# Altium project BATT_ctrl_v2.3.PrjPcb
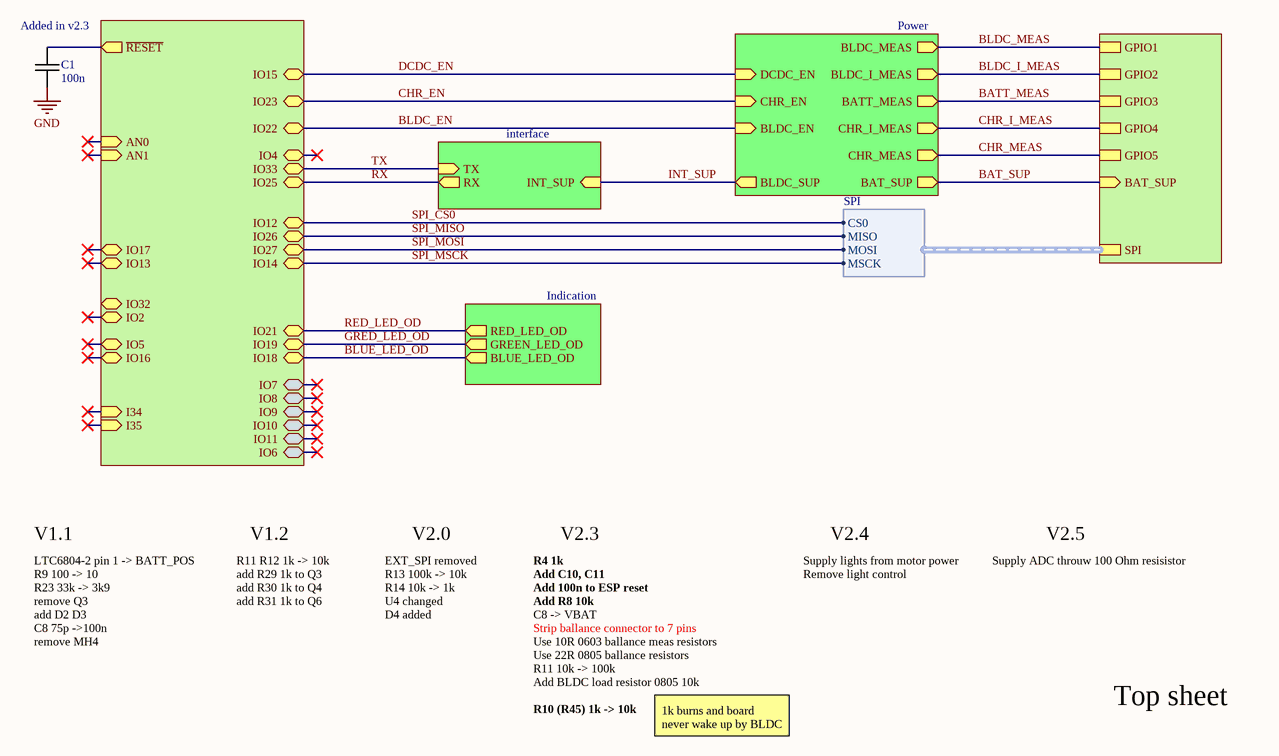
[diagram p0: top_sheet.SchDoc]
4 sheets, 67 parts. Net scope: hierarchical (ports join the sheet entries above them; power ports are global).
Board file: batt_ctrl_pcb_v2.5.PcbDoc
Sheets:
  top_sheet.SchDoc
    Power = power.SchDoc
    interface = data_interface.SchDoc
    Indication = indication.SchDoc

## Sheet top_sheet.SchDoc
size A4; SheetNumber: 1; SheetTotal: 7

### Parts
C1  100n  [CAPC0603(1608)55_N]

### Sub-sheets
Indication = indication.SchDoc: RED_LED_OD (out), GREEN_LED_OD (out), BLUE_LED_OD (out)
interface = data_interface.SchDoc: TX (in), RX (out), INT_SUP (in)
Power = power.SchDoc: BLDC_EN (in), BLDC_I_MEAS (out), CHR_EN (in), CHR_I_MEAS (out), BLDC_MEAS (out), CHR_MEAS (out), BATT_MEAS (out), BAT_SUP (out), DCDC_EN (in), BLDC_SUP (out)
U_ESP32_WROOM2 = ESP32_WROOM2 (file not in this document): IO25 (bidir), IO26 (bidir), IO27 (bidir), IO22 (bidir), IO23 (bidir), IO32 (bidir), IO19 (bidir), IO21 (bidir), IO33 (bidir), IO14 (bidir), IO12 (bidir), IO15 (bidir), IO16 (bidir), IO17 (bidir), IO18 (bidir), IO13 (bidir), I34 (in), I35 (in), IO5 (bidir), IO4 (bidir), IO2 (bidir), AN0 (in), AN1 (in), IO7 (bidir), IO8 (bidir), IO9 (bidir), IO10 (bidir), IO11 (bidir), IO6 (bidir), ~{RESET} (out)
U_LTC6804-2_BMS_TR = LTC6804-2_BMS_TR (file not in this document): SPI (harness SPI), GPIO1, GPIO2, GPIO3, GPIO4, GPIO5, BAT_SUP (in)

### Harnesses
SPI: CS0, MISO, MOSI, MSCK

### Nets
BAT_SUP: sheet Power/BAT_SUP, sheet U_LTC6804-2_BMS_TR/BAT_SUP
GND: C1.2
BATT_MEAS: sheet Power/BATT_MEAS, sheet U_LTC6804-2_BMS_TR/GPIO3
BLDC_EN: sheet U_ESP32_WROOM2/IO22, sheet Power/BLDC_EN
BLDC_I_MEAS: sheet Power/BLDC_I_MEAS, sheet U_LTC6804-2_BMS_TR/GPIO2
BLDC_MEAS: sheet Power/BLDC_MEAS, sheet U_LTC6804-2_BMS_TR/GPIO1
BLUE_LED_OD: sheet U_ESP32_WROOM2/IO18, sheet Indication/BLUE_LED_OD
CHR_EN: sheet U_ESP32_WROOM2/IO23, sheet Power/CHR_EN
CHR_I_MEAS: sheet Power/CHR_I_MEAS, sheet U_LTC6804-2_BMS_TR/GPIO4
CHR_MEAS: sheet Power/CHR_MEAS, sheet U_LTC6804-2_BMS_TR/GPIO5
DCDC_EN: sheet U_ESP32_WROOM2/IO15, sheet Power/DCDC_EN
GRED_LED_OD: sheet U_ESP32_WROOM2/IO19, sheet Indication/GREEN_LED_OD
INT_SUP: sheet Power/BLDC_SUP, sheet interface/INT_SUP  [project net BLDC_POS]
RED_LED_OD: sheet U_ESP32_WROOM2/IO21, sheet Indication/RED_LED_OD
RX: sheet U_ESP32_WROOM2/IO25, sheet interface/RX
SPI_CS0: sheet U_ESP32_WROOM2/IO12, sheet U_LTC6804-2_BMS_TR/SPI.CS0
SPI_MISO: sheet U_ESP32_WROOM2/IO26, sheet U_LTC6804-2_BMS_TR/SPI.MISO
SPI_MOSI: sheet U_ESP32_WROOM2/IO27, sheet U_LTC6804-2_BMS_TR/SPI.MOSI
SPI_MSCK: sheet U_ESP32_WROOM2/IO14, sheet U_LTC6804-2_BMS_TR/SPI.MSCK
TX: sheet U_ESP32_WROOM2/IO33, sheet interface/TX
NetC1_1: C1.1 ; sheet U_ESP32_WROOM2/~{RESET}

### Notes on the sheet
- (near C1) Added in v2.3
- V1.1
- LTC6804-2 pin 1 -> BATT_POS
- R11 R12 1k -> 10k
- V1.2
- EXT_SPI removed
- V2.0
- R4 1k
- V2.3
- Supply lights from motor power
- V2.4
- Supply ADC throuw 100 Ohm resisistor
- V2.5
- R9 100 -> 10
- R23 33k -> 3k9
- remove Q3
- add D2 D3
- C8 75p ->100n
- add R29 1k to Q3
- add R30 1k to Q4
- add R31 1k to Q6
- R13 100k -> 10k
- R14 10k -> 1k
- U4 changed
- D4 added
- Add C10, C11
- Add 100n to ESP reset
- Strip ballance connector to 7 pins
- C8 -> VBAT
- Add R8 10k
- Remove light control
- remove MH4
- Use 10R 0603 ballance meas resistors
- R11 10k -> 100k
- Use 22R 0805 ballance resistors
- Add BLDC load resistor 0805 10k
- Top sheet
- R10 (R45) 1k -> 10k
- 1k burns and board never wake up by BLDC

### Library data of the parts
C1 = Capacitor M: Ceramic capacitor Medium density; Value: 100n

## Sheet power.SchDoc
size A4; SheetNumber: 2; SheetTotal: 7
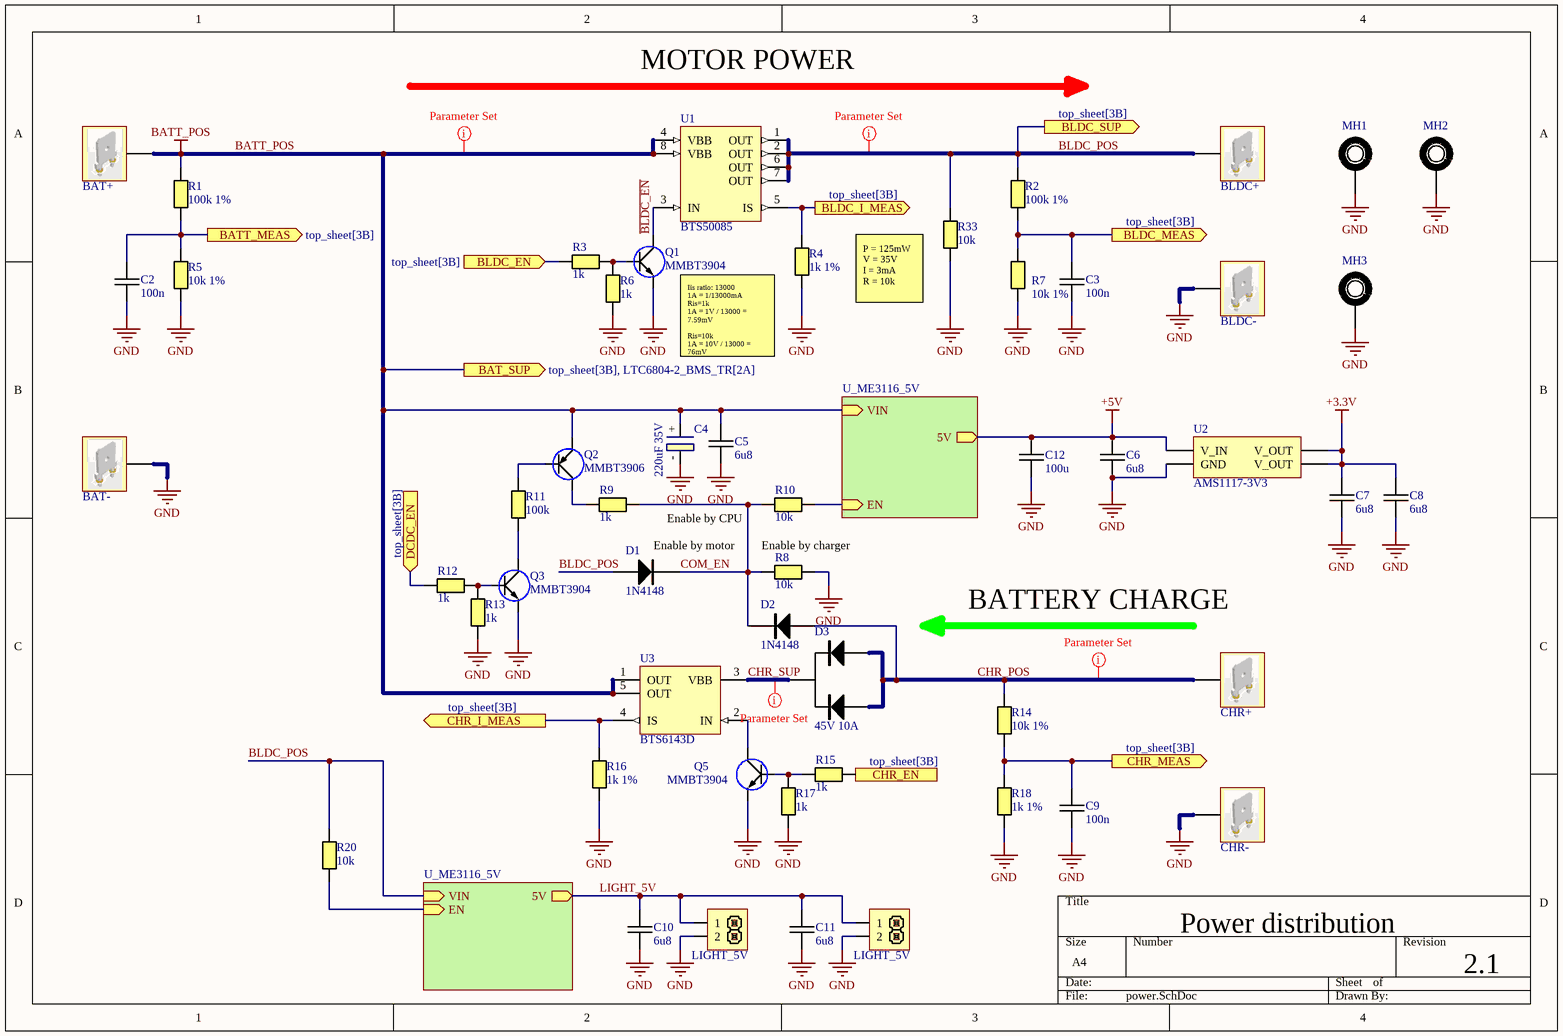
[diagram p1: power.SchDoc]

### Parts
BAT+  Crimp 6.3 single PCB  [Crimp 6.3mm single PCB]  (value not drawn)
BAT-  Crimp 6.3 single PCB  [Crimp 6.3mm single PCB]  (value not drawn)
BLDC+  Crimp 6.3 single PCB  [Crimp 6.3mm single PCB]  (value not drawn)
BLDC-  Crimp 6.3 single PCB  [Crimp 6.3mm single PCB]  (value not drawn)
C2  100n  [CAPC0603(1608)55_N]
C3  100n  [CAPC0603(1608)55_N]
C4  220uF 35V  [10x10.5 Capacitor]
C5  6u8  [CAPC0805(2012)75_N]
C6  6u8  [CAPC0805(2012)75_N]
C7  6u8  [CAPC0805(2012)75_N]
C8  6u8  [CAPC0805(2012)75_N]
C9  100n  [CAPC0603(1608)55_N]
C10  6u8  [CAPC0805(2012)75_N]
C11  6u8  [CAPC0805(2012)75_N]
C12  100u  [CAPC1206(3216)75_N]
CHR+  Crimp 6.3 single PCB  [Crimp 6.3mm single PCB]  (value not drawn)
CHR-  Crimp 6.3 single PCB  [Crimp 6.3mm single PCB]  (value not drawn)
CN1  PIN HEADER 1x2  [XH2.54 2P]  (value not drawn)
CN2  PIN HEADER 1x2  [XH2.54 2P]  (value not drawn)
D1  1N4148  [SOD80]
D2  1N4148  [SOD80]
D3  45V 10A  [DPAK]
MH1  Mounting Hole  [MH_M3]  (value not drawn)
MH2  Mounting Hole  [MH_M3]  (value not drawn)
MH3  Mounting Hole  [MH_M3]  (value not drawn)
Q1  MMBT3904  [SOT23]
Q2  MMBT3906  [SOT23]
Q3  MMBT3904  [SOT23]
Q5  MMBT3904  [SOT23]
R1  100k 1%  [RESC0603(1608)_N]
R2  100k 1%  [RESC0603(1608)_N]
R3  1k  [RESC0603(1608)_N]
R4  1k 1%  [RESC0603(1608)_N]
R5  10k 1%  [RESC0603(1608)_N]
R6  1k  [RESC0603(1608)_N]
R7  10k 1%  [RESC0603(1608)_N]
R8  10k  [RESC0603(1608)_N]
R9  1k  [RESC0603(1608)_N]
R10  10k  [RESC0603(1608)_N]
R11  100k  [RESC0603(1608)_N]
R12  1k  [RESC0603(1608)_N]
R13  1k  [RESC0603(1608)_N]
R14  10k 1%  [RESC0603(1608)_N]
R15  1k  [RESC0603(1608)_N]
R16  1k 1%  [RESC0603(1608)_N]
R17  1k  [RESC0603(1608)_N]
R18  1k 1%  [RESC0603(1608)_N]
R20  10k  [RESC0603(1608)_N]
R33  10k  [RESC0805(2012)_N]
U1  BTS50085  [PG-TO220-7-4]
U2  AMS1117-3V3  [SOT229P700X180-4N]
U3  BTS6143D  [ITO252-5-11_M]

### Sub-sheets
U_ME3116_5V = ME3116_5V (file not in this document): EN (in), VIN (in), 5V (out)
U_ME3116_5V = ME3116_5V (file not in this document): EN (in), VIN (in), 5V (out)

### Ports
BAT_SUP (out, see top_sheet[3B], LTC6804-2_BMS_TR[2A]), BATT_MEAS (out, see top_sheet[3B]), BLDC_EN (in, see top_sheet[3B]), BLDC_I_MEAS (out, see top_sheet[3B]), BLDC_MEAS (out, see top_sheet[3B]), BLDC_SUP (out, see top_sheet[3B]), CHR_EN (in, see top_sheet[3B]), CHR_I_MEAS (out, see top_sheet[3B]), CHR_MEAS (out, see top_sheet[3B]), DCDC_EN (in, see top_sheet[3B])

### Nets
+3.3V: C7.1 C8.1 U2.2(V_OUT) U2.4(V_OUT)
+5V: C6.1 C12.1 U2.3(V_IN) ; sheet U_ME3116_5V/5V
BATT_POS: BAT+.1 C4.+ C5.2 Q2.2(E) R1.2 U1.4(VBB) U1.8(VBB) U3.1(OUT) U3.5(OUT) ; port BAT_SUP, sheet U_ME3116_5V/VIN  [project net BAT_SUP]
GND: BAT-.1 BLDC-.1 C2.2 C3.2 C4.- C5.1 C6.2 C7.2 C8.2 C9.2 C10.2 C11.2 C12.2 CHR-.1 CN1.2 CN2.2 MH1.1 MH2.1 MH3.1 Q1.2(E) Q3.2(E) Q5.2(E) R4.1 R5.1 R6.1 R7.1 R8.2 R13.1 R16.1 R17.1 R18.1 R33.1 U2.1(GND)
~{BLDC_EN}: Q1.3(C) U1.3(IN)
BATT_MEAS: C2.1 R1.1 R5.2 ; port BATT_MEAS
BLDC_EN: R3.1 ; port BLDC_EN
BLDC_I_MEAS: R4.2 U1.5(IS) ; port BLDC_I_MEAS
BLDC_MEAS: C3.1 R2.1 R7.2 ; port BLDC_MEAS
BLDC_POS: BLDC+.1 D1.1(A) R2.2 R20.2 R33.2 U1.1(OUT) U1.2(OUT) U1.6(OUT) U1.7(OUT) ; port BLDC_SUP, sheet U_ME3116_5V/VIN
CHR_EN: R15.1 ; port CHR_EN
CHR_I_MEAS: R16.2 U3.4(IS) ; port CHR_I_MEAS
CHR_MEAS: C9.1 R14.1 R18.2 ; port CHR_MEAS
CHR_POS: CHR+.1 D2.1(A) D3.1(A1) D3.3(A2) R14.2
CHR_SUP: D3.2(K) U3.3(VBB)
COM_EN: D1.2(K) D2.2(K) R8.1 R9.1 R10.2
DCDC_EN: R12.1 ; port DCDC_EN
LIGHT_5V: C10.1 C11.1 CN1.1 CN2.1 ; sheet U_ME3116_5V/5V
NetQ1_1: Q1.1(B) R3.2 R6.2
NetQ2_1: Q2.1(B) R11.1
NetQ2_3: Q2.3(C) R9.2
NetQ3_1: Q3.1(B) R12.2 R13.2
NetQ3_3: Q3.3(C) R11.2
NetQ5_1: Q5.1(B) R15.2 R17.2
NetQ5_3: Q5.3(C) U3.2(IN)
NetR10_1: R10.1 ; sheet U_ME3116_5V/EN
NetR20_1: R20.1 ; sheet U_ME3116_5V/EN

### Layout directives
net class Direct; net class HV: BAT_SUP, BLDC_POS, CHR_POS, CHR_SUP

### Notes on the sheet
- MOTOR POWER
- (near R33) P = 125mW
  V = 35V
  I = 3mA
  R = 10k
- Iis ratio: 13000
  1A = 1/13000mA
  Ris=1k
  1A = 1V / 13000 = 7.59mV
  Ris=10k
  1A = 10V / 13000 = 76mV
- Enable by CPU
- (near D1) Enable by motor
- Enable by charger
- BATTERY CHARGE
- Power distribution
- 2.1

### Library data of the parts
BAT+ BAT- BLDC+ BLDC- CHR+ CHR- = Crimp 6.3 single PCB: Straight Mount Angle PCB Tab Terminal
  BAT- BLDC- CHR-: ClassName: DirectGND
C2 C3 C5-C12 = Capacitor M: Ceramic capacitor Medium density
  C2 C3 C9: Value: 100n
  C5-C8 C10 C11: Value: 6u8
  C12: Value: 100u
C4 = Capacitor Electrolitic: Value: 220uF 35V
CN1 CN2 = PIN HEADER 2.54 1x2: LIGHT_5V; Parameter 1: LIGHT_5V
D1 D2 = 1N4148: Small Signal Fast Switching Diodes; Repetitive peak reverse voltage: 100 V; Reverse voltage: 75 V; Peak forward surge current: 2 A; Repetitive peak forward current: 500 mA; Forward continuous current: 300 mA; Average forward current: 150 mA; Diode capacitance: 4 pF; Reverse recovery time: 4 ~ 8 ns; Supplier 1: Mouser; Supplier Part Number 1: 78-MCL4148
D3 = STPS1045B: Power schottky rectifier; V: 45V; I: 10A
Q1 Q3 Q5 = 2N3904: NPN General Purpose Transistor; Collector-Emitter Voltage: 40V; Collector-Base Voltage: 60V; Collector Current - Continuous: 200mA; DC Current Gain: 300
Q2 = 2N3906: PNP General Purpose Transistor; Collector-Emitter Voltage: -40V; Collector-Base Voltage: -60V; Collector Current - Continuous: 200mA; DC Current Gain: 300
R1-R18 R20 R33 = Resistor M: Resistor Medium Density
  R1 R2: Value: 100k 1%
  R3 R6 R9 R12 R13 R15 R17: Value: 1k
  R4 R16 R18: Value: 1k 1%
  R5 R7 R14: Value: 10k 1%
  R8 R10 R20 R33: Value: 10k
  R11: Value: 100k
U1 = BTS50085-1TMA: Smart Highside High Current Power Switch; Overvoltage protection: 70V; Output clamp: 62V; Operating voltage: 5.0 .. 58V; On-state resistance: 9 mOhm; Load current (ISO): 44A; Short circuit current limitation: 90A; Current sense ratio: 13000
U2 = AMS1117: 800mA LDO  15V max
U3 = BTS6143D: PROFET Smart Highside Power Switch, 1 Channel, 10 A Load Current, -40 to 150 degC, PG-TO252-5-11, Reel, Green; Manufacturer: Infineon; Recommended Operating Voltage Min.: 5.5 V; RON(max) @ 150degreesC: 18 mOhm; toff (max): 500 us; Load Current (typ): 10 A; RON @ 25degreesC: 10 mOhm; Recommended Operating Voltage Max.: 38 V; Green: TRUE; Ptot (max): 59 W; Group: Automotive Qualified; Channels: 1; Packing: Reel; ComponentLink1URL: http://www.infineon.com/; PartNumber: BTS6143D; Mounting Technology: Surface Mount; ComponentLink2Description: Datasheet; ComponentLink3URL: http://www.infineon.com/dgdl/TLE7276-Data+Sheet-+v1_11.pdf?folderId=db3a304412b407950112b408e8c90004&fileId=db3a304412b407950112b436c53f66c8&sId=db3a30433db6f09f013dc0e43c0428c1; ComponentLink3Description: Package Specification; ComponentLink2URL: http://www.infineon.com/dgdl/BTS6143D_DS_v10.pdf?folderId=db3a304314dca389011537739e37155f&fileId=db3a3043183a95550118606a2705368e&location=en.Products.Automotive_ICs.Smart_High-_and_Low-Side_Switches.PROFET__-_Smart_High_Side_Switches.DATASHEET.BTS6143D_D; ComponentLink1Description: Manufacturer URL; PackageVersion: Nov-10; PackageDescription: 5-Pin Plastic (Green) Transistor Single Outline Package, 6.5 x 6.12 mm Body, 1.14 mm Pitch; Halogen-free: TRUE; DatasheetVersion: Rev. 1.0; PackageReference: PG-TO252-5-11; ton (max): 500 us
MH1-MH3 = Mounting Hole: ClassName: DirectGND

## Sheet data_interface.SchDoc
size A4; SheetNumber: 3; SheetTotal: 7
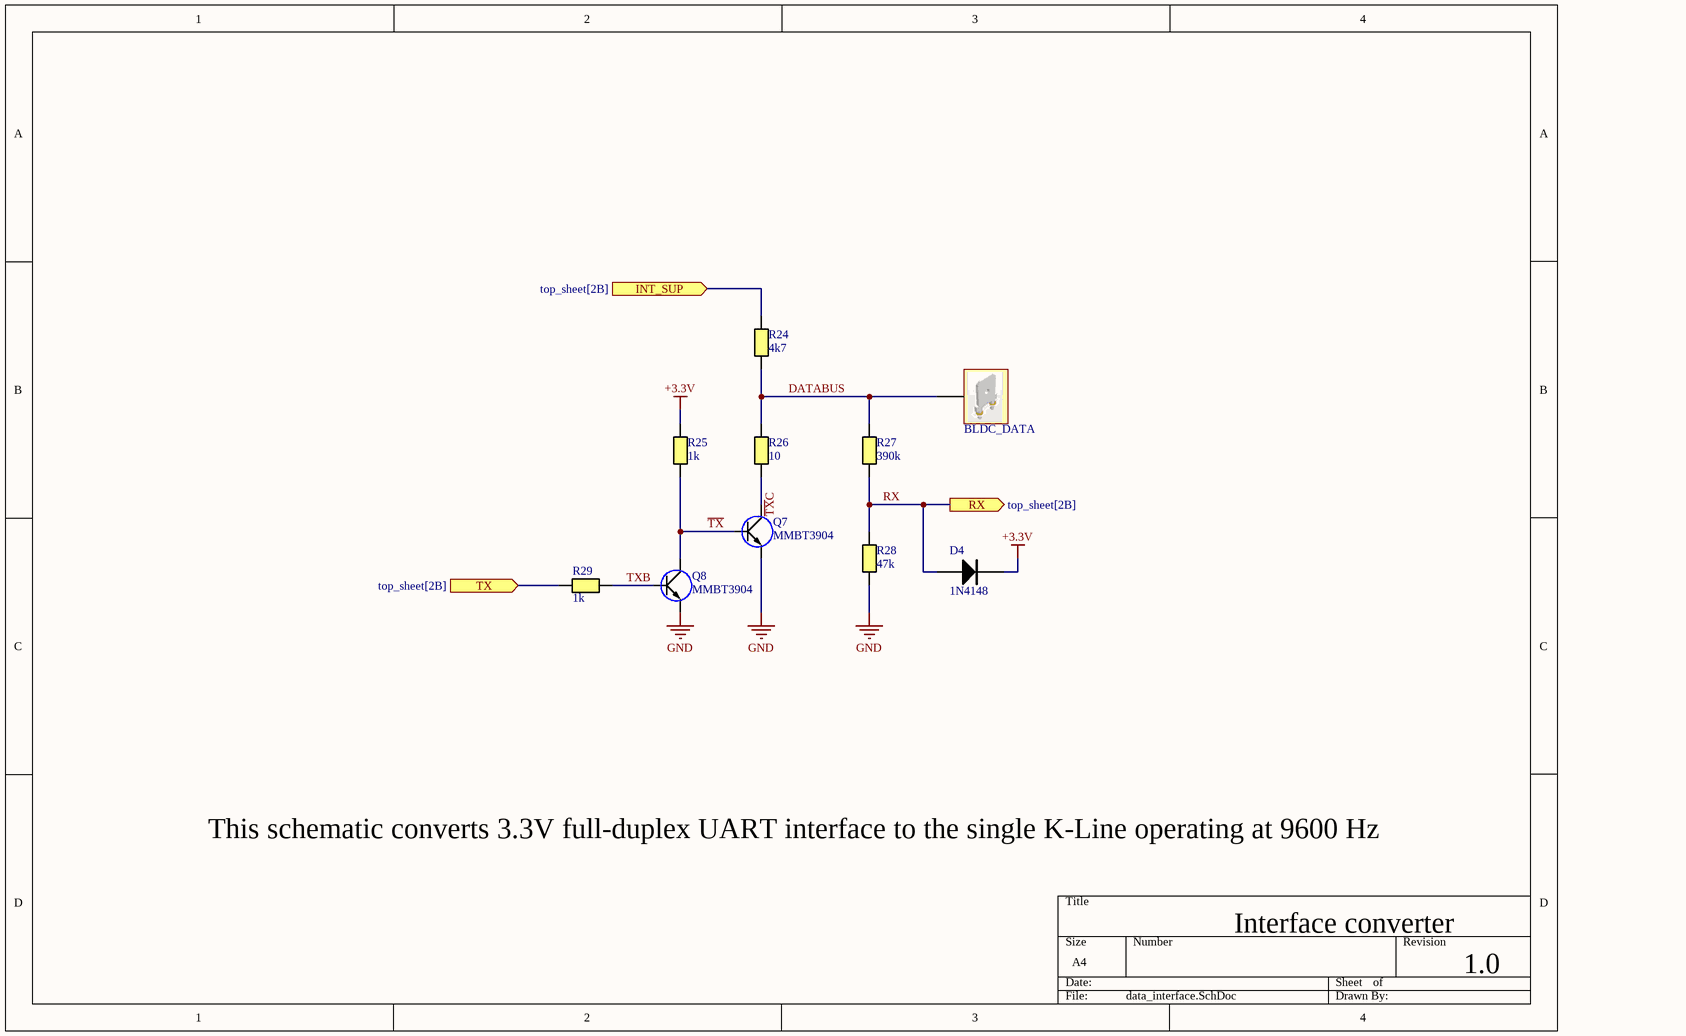
[diagram p2: data_interface.SchDoc]

### Parts
BLDC_DATA  Crimp 6.3 single PCB  [Crimp 6.3mm single PCB]  (value not drawn)
D4  1N4148  [SOD80]
Q7  MMBT3904  [SOT23]
Q8  MMBT3904  [SOT23]
R24  4k7  [RESC0603(1608)_N]
R25  1k  [RESC0603(1608)_N]
R26  10  [RESC0603(1608)_N]
R27  390k  [RESC0603(1608)_N]
R28  47k  [RESC0603(1608)_N]
R29  1k  [RESC0603(1608)_N]

### Ports
INT_SUP (in, see top_sheet[2B]), RX (out, see top_sheet[2B]), TX (in, see top_sheet[2B])

### Nets
+3.3V: D4.2(K) R25.2
GND: Q7.2(E) Q8.2(E) R28.1
BLDC_POS: R24.2 ; port INT_SUP
DATABUS: BLDC_DATA.1 R24.1 R26.2 R27.2
RX: D4.1(A) R27.1 R28.2 ; port RX
~{TX}: Q7.1(B) Q8.3(C) R25.1
~{TX}C: Q7.3(C) R26.1
TX: R29.1 ; port TX
TXB: Q8.1(B) R29.2

### Notes on the sheet
- This schematic converts 3.3V full-duplex UART interface to the single K-Line operating at 9600 Hz
- Interface converter
- 1.0

### Library data of the parts
BLDC_DATA = Crimp 6.3 single PCB: Straight Mount Angle PCB Tab Terminal
D4 = 1N4148: as D1 on sheet power; Supplier 1: Mouser; Supplier Part Number 1: 78-MCL4148
Q7 Q8 = 2N3904: as Q1 on sheet power
R24-R29 = Resistor M: Resistor Medium Density
  R24: Value: 4k7
  R25 R29: Value: 1k
  R26: Value: 10
  R27: Value: 390k
  R28: Value: 47k

## Sheet indication.SchDoc
size A4; SheetNumber: 4; SheetTotal: 7
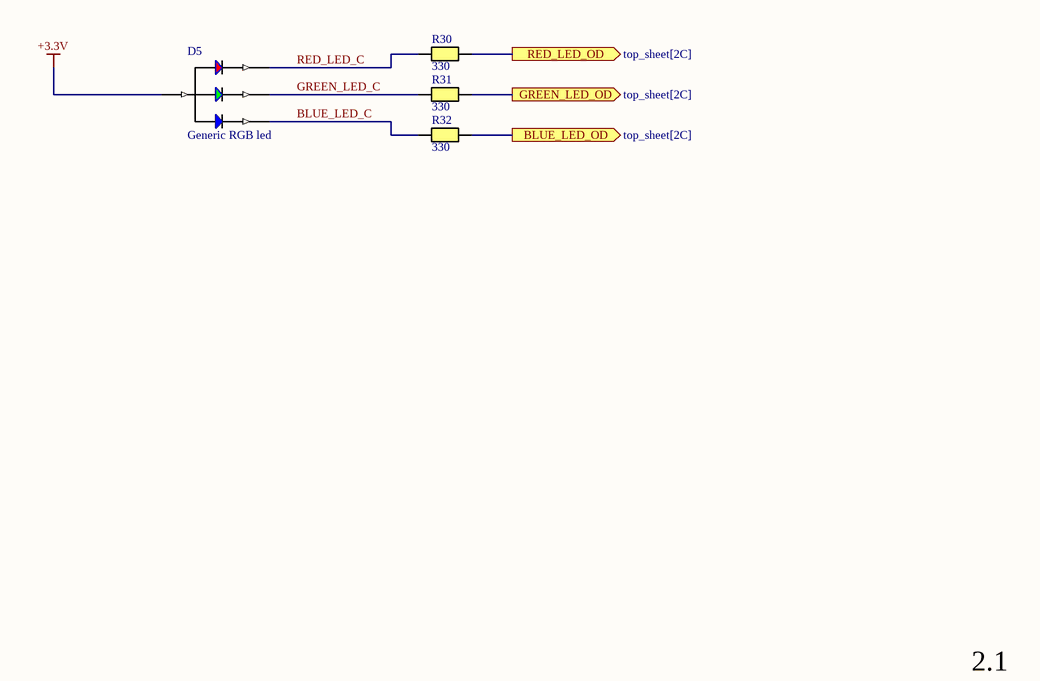
[diagram p3: indication.SchDoc]

### Parts
D5  Generic RGB led  [RGB throu hole 90 deg]
R30  330  [RESC0603(1608)_N]
R31  330  [RESC0603(1608)_N]
R32  330  [RESC0603(1608)_N]

### Ports
BLUE_LED_OD (out, see top_sheet[2C]), GREEN_LED_OD (out, see top_sheet[2C]), RED_LED_OD (out, see top_sheet[2C])

### Nets
+3.3V: D5.CA
BLUE_LED_C: D5.BC R32.1
BLUE_LED_OD: R32.2 ; port BLUE_LED_OD
GRED_LED_OD: R31.2 ; port GREEN_LED_OD
GREEN_LED_C: D5.GC R31.1
RED_LED_C: D5.RC R30.1
RED_LED_OD: R30.2 ; port RED_LED_OD

### Notes on the sheet
- 2.1

### Library data of the parts
D5 = RGB led
R30-R32 = Resistor M: Resistor Medium Density; Value: 330

## Nets that join several sheets
+3.3V: power (C7.1 C8.1 U2.2 U2.4), data_interface (D4.2 R25.2), indication (D5.CA)
GND: top_sheet (C1.2), power (33 pins), data_interface (Q7.2 Q8.2 R28.1)
BLDC_POS: power (9 pins), data_interface (R24.2)